# Altium schematic sheet FPGA_52_Keyboard.SchDoc
size B; Organization: Altium Limited; Address1: L3, 12a Rodborough Rd; Address2: Frenchs Forest; Address3: NSW; Address4: Australia 2086; DocumentNumber: 1; SheetNumber: 1; SheetTotal: 2
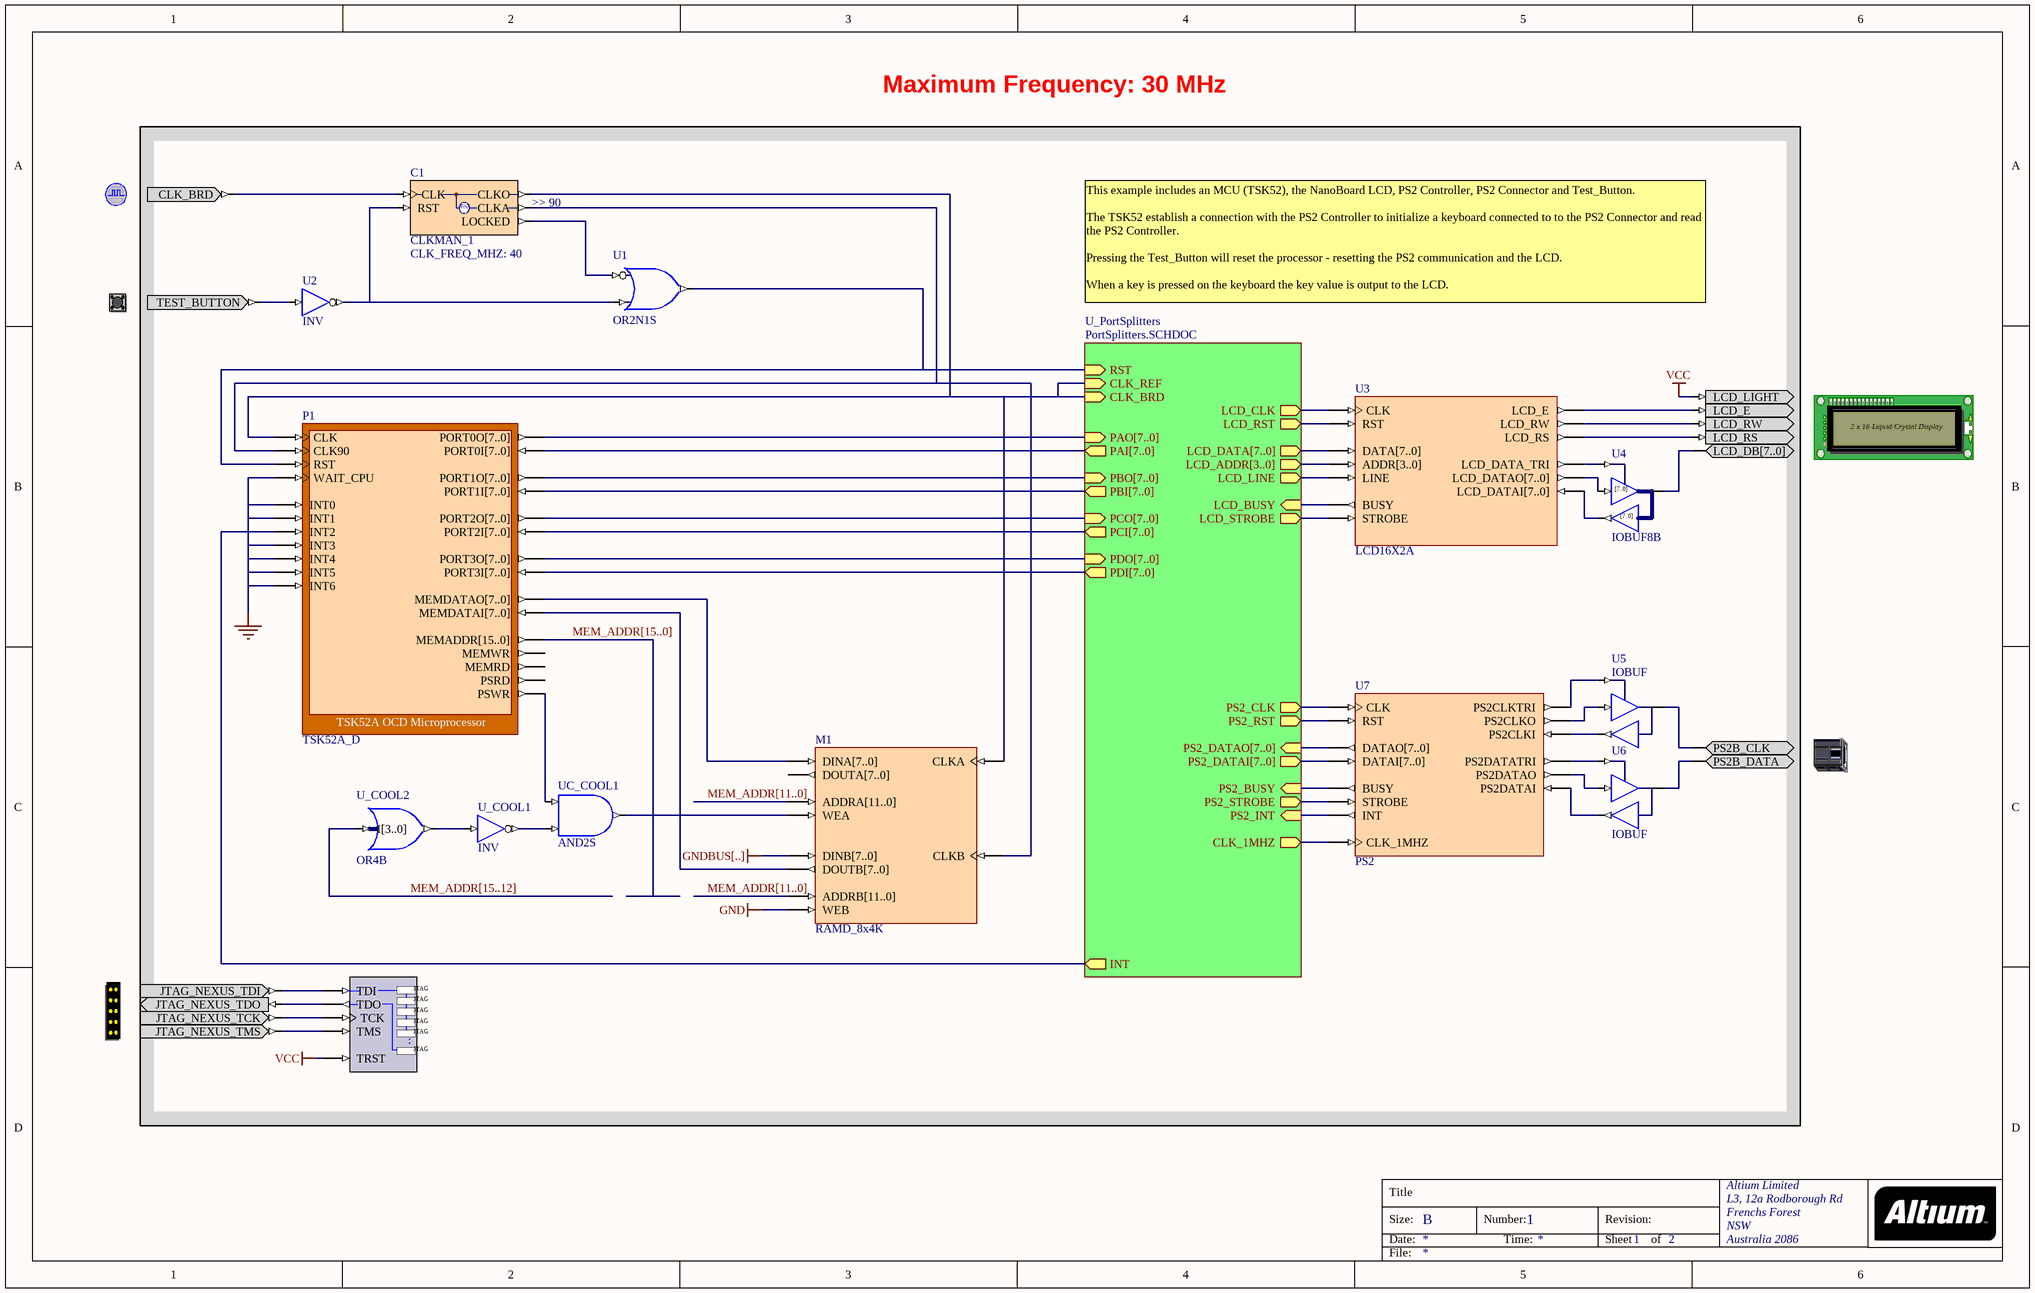
[diagram p0: FPGA_52_Keyboard.SchDoc]

## Parts
(Parts that share a designator on the sheet are numbered #1, #2 ... from top to bottom, then left to right.)
?#1  CLOCK_BOARD  (value not drawn)
?#2  TEST_BUTTON  (value not drawn)
?#3  LCD  (value not drawn)
?#4  PS2B  (value not drawn)
?#5  NEXUS_JTAG_CONNECTOR  (value not drawn)
C1  CLKMAN_1  CLK_FREQ_MHZ: 40  ClkA_Operation: >> 90
M1  RAMD_8x4K
NEXUS_JTAG_PORT  NEXUS_JTAG_PORT  (value not drawn)
P1  TSK52A_D
U1  OR2N1S
U2  INV
U3  LCD16X2A
U4  IOBUF8B
U5  IOBUF
U6  IOBUF
U7  PS2
U_COOL1  INV
U_COOL2  OR4B
UC_COOL1  AND2S

## Sub-sheets
U_PortSplitters = PortSplitters.SCHDOC: PAO[7..0] (in), PBO[7..0] (in), PCO[7..0] (in), PDO[7..0] (in), PAI[7..0] (out), PBI[7..0] (out), PCI[7..0] (out), PDI[7..0] (out), LCD_DATA[7..0] (out), LCD_ADDR[3..0] (out), LCD_LINE (out), LCD_STROBE (out), LCD_BUSY (in), PS2_DATAI[7..0] (out), PS2_BUSY (in), PS2_STROBE (out), PS2_INT (in), INT (out), CLK_1MHZ (out), CLK_REF (in), CLK_BRD (in), RST (in), PS2_CLK (out), PS2_RST (out), LCD_RST (out), LCD_CLK (out), PS2_DATAO[7..0] (in)

## Nets
GND: M1.WEB P1.INT0 P1.INT1 P1.INT3 P1.INT4 P1.INT5 P1.INT6 P1.WAIT_CPU
GNDBUS[..]: M1.DINB[7..0]
VCC: ?#3.LCD_LIGHT NEXUS_JTAG_PORT.TRST
MEM_ADDR[11..0]: M1.ADDRA[11..0] M1.ADDRB[11..0]
MEM_ADDR[15..0]: P1.MEMADDR[15..0]
MEM_ADDR[15..12]: U_COOL2.I[3..0]
Net?#1_CLK_BRD: ?#1.CLK_BRD C1.CLK
Net?#2_TEST_BUTTON: ?#2.TEST_BUTTON U2.I
Net?#3_LCD_DB[7..0]: ?#3.LCD_DB[7..0] U4.IO[7..0]
Net?#3_LCD_E: ?#3.LCD_E U3.LCD_E
Net?#3_LCD_RS: ?#3.LCD_RS U3.LCD_RS
Net?#3_LCD_RW: ?#3.LCD_RW U3.LCD_RW
Net?#4_PS2B_CLK: ?#4.PS2B_CLK U5.IO
Net?#4_PS2B_DATA: ?#4.PS2B_DATA U6.IO
Net?#5_JTAG_NEXUS_TCK: ?#5.JTAG_NEXUS_TCK NEXUS_JTAG_PORT.TCK
Net?#5_JTAG_NEXUS_TDI: ?#5.JTAG_NEXUS_TDI NEXUS_JTAG_PORT.TDI
Net?#5_JTAG_NEXUS_TDO: ?#5.JTAG_NEXUS_TDO NEXUS_JTAG_PORT.TDO
Net?#5_JTAG_NEXUS_TMS: ?#5.JTAG_NEXUS_TMS NEXUS_JTAG_PORT.TMS
NetC1_CLKA: C1.CLKA M1.CLKB P1.CLK90
NetC1_CLKO: C1.CLKO M1.CLKA P1.CLK ; sheet U_PortSplitters/CLK_REF, sheet U_PortSplitters/CLK_BRD
NetC1_LOCKED: C1.LOCKED U1.I0
NetC1_RST: C1.RST U1.I1 U2.O
NetM1_DINA[7..0]: M1.DINA[7..0] P1.MEMDATAO[7..0]
NetM1_DOUTB[7..0]: M1.DOUTB[7..0] P1.MEMDATAI[7..0]
NetM1_WEA: M1.WEA UC_COOL1.O
NetP1_INT2: P1.INT2 ; sheet U_PortSplitters/INT
NetP1_PORT0I[7..0]: P1.PORT0I[7..0] ; sheet U_PortSplitters/PAI[7..0]
NetP1_PORT0O[7..0]: P1.PORT0O[7..0] ; sheet U_PortSplitters/PAO[7..0]
NetP1_PORT1I[7..0]: P1.PORT1I[7..0] ; sheet U_PortSplitters/PBI[7..0]
NetP1_PORT1O[7..0]: P1.PORT1O[7..0] ; sheet U_PortSplitters/PBO[7..0]
NetP1_PORT2I[7..0]: P1.PORT2I[7..0] ; sheet U_PortSplitters/PCI[7..0]
NetP1_PORT2O[7..0]: P1.PORT2O[7..0] ; sheet U_PortSplitters/PCO[7..0]
NetP1_PORT3I[7..0]: P1.PORT3I[7..0] ; sheet U_PortSplitters/PDI[7..0]
NetP1_PORT3O[7..0]: P1.PORT3O[7..0] ; sheet U_PortSplitters/PDO[7..0]
NetP1_PSWR: P1.PSWR UC_COOL1.I0
NetP1_RST: P1.RST U1.O ; sheet U_PortSplitters/RST
NetU3_ADDR[3..0]: U3.ADDR[3..0] ; sheet U_PortSplitters/LCD_ADDR[3..0]
NetU3_BUSY: U3.BUSY ; sheet U_PortSplitters/LCD_BUSY
NetU3_CLK: U3.CLK ; sheet U_PortSplitters/LCD_CLK
NetU3_DATA[7..0]: U3.DATA[7..0] ; sheet U_PortSplitters/LCD_DATA[7..0]
NetU3_LCD_DATA_TRI: U3.LCD_DATA_TRI U4.T
NetU3_LCD_DATAI[7..0]: U3.LCD_DATAI[7..0] U4.O[7..0]
NetU3_LCD_DATAO[7..0]: U3.LCD_DATAO[7..0] U4.I[7..0]
NetU3_LINE: U3.LINE ; sheet U_PortSplitters/LCD_LINE
NetU3_RST: U3.RST ; sheet U_PortSplitters/LCD_RST
NetU3_STROBE: U3.STROBE ; sheet U_PortSplitters/LCD_STROBE
NetU5_I: U5.I U7.PS2CLKO
NetU5_O: U5.O U7.PS2CLKI
NetU5_T: U5.T U7.PS2CLKTRI
NetU6_I: U6.I U7.PS2DATAO
NetU6_O: U6.O U7.PS2DATAI
NetU6_T: U6.T U7.PS2DATATRI
NetU7_BUSY: U7.BUSY ; sheet U_PortSplitters/PS2_BUSY
NetU7_CLK: U7.CLK ; sheet U_PortSplitters/PS2_CLK
NetU7_CLK_1MHZ: U7.CLK_1MHZ ; sheet U_PortSplitters/CLK_1MHZ
NetU7_DATAI[7..0]: U7.DATAI[7..0] ; sheet U_PortSplitters/PS2_DATAI[7..0]
NetU7_DATAO[7..0]: U7.DATAO[7..0] ; sheet U_PortSplitters/PS2_DATAO[7..0]
NetU7_INT: U7.INT ; sheet U_PortSplitters/PS2_INT
NetU7_RST: U7.RST ; sheet U_PortSplitters/PS2_RST
NetU7_STROBE: U7.STROBE ; sheet U_PortSplitters/PS2_STROBE
NetU_COOL1_I: U_COOL1.I U_COOL2.O
NetU_COOL1_O: U_COOL1.O UC_COOL1.I1

Not connected (* = marked no-connect by the designer): M1 DOUTA[7..0]; P1 MEMRD MEMWR PSRD

## Buses and harness runs
bus MEM_ADDR[11..0]
bus MEM_ADDR[15..0]
bus MEM_ADDR[15..12]

## Notes on the sheet
- Maximum Frequency: 30 MHz
- This example includes an MCU (TSK52), the NanoBoard LCD, PS2 Controller, PS2 Connector and Test_Button.
  The TSK52 establish a connection with the PS2 Controller to initialize a keyboard connected to to the PS2 Connector and read the PS2 Controller.
  Pressing the Test_Button will reset the processor - resetting the PS2 communication and the LCD.
  When a key is pressed on the keyboard the key value is output to the LCD.
- Title
- Size:
- Date:
- B
- Number:
- Time:
- Revision:
- Sheet
- of
- File:
- (in symbol CLKMAN_1) F(x)
- (in symbol IOBUF8B) [7..0]
- (in symbol LCD) 2 x 16 Liquid Crystal Display
- (in symbol NEXUS_JTAG_PORT) JTAG; .

## Library data of the parts
?#1 = CLOCK_BOARD: Global System Clock Supply; PortComponent: True; Published: 19-Nov-2003; Publisher: Altium Limited
?#2 = TEST_BUTTON: Test Button; PortComponent: True; Published: 19-Nov-2003; Publisher: Altium Limited
?#3 = LCD: Liquid Crystal Display; PortComponent: True; Published: 19-Nov-2003; Publisher: Altium Limited
?#4 = PS2B: Key Board PS2 Connector; PortComponent: True; Published: 19-Nov-2003; Publisher: Altium Limited
?#5 = NEXUS_JTAG_CONNECTOR: JTAG Port; PortComponent: True; Published: 19-Nov-2003; Publisher: Altium Limited
C1 = CLKMAN_1: Single Operational Output Clock Manager; Clk_Count: 1; Published: 5-Jul-2004; Publisher: Altium Limited; Core Revision: 1.00.00; Nexus_Core: ClockManager; HelpURL: CR0118 FPGA Generic Library Guide.pdf#page=148; Functional Class: Clock Manager; Port Size: 1
M1 = RAMD_8x4K: Dual Port Random Access Memory; Memory_DepthA: 4096; Memory_Type: RAM_DualPortBlock; Memory_WidthA: 8; Memory_ClockEdge: Rising; Nexus_Core: Memory_Program; Published: 13/01/2004; Publisher: Altium Hobart Technology Center; Memory_DepthB: 4096; Memory_WidthB: 8
NEXUS_JTAG_PORT = NEXUS_JTAG_PORT: Soft Nexus-Chain Connector; NEXUS_JTAG_CONNECTOR: True; Published: 18-Dec-2003; Publisher: Altium Limited
P1 = TSK52A_D: TSK52A OCD Microprocessor; NEXUS_CORE: Processor_OCDS; NEXUS_JTAG_DEVICE: True; NEXUS_JTAG_ORDER: 0; ChildModel1: TSK52A_D_DRAM8X256; ChildCore1: M1; Memory_Configuration: Record[NEXUS_CORE]{}ComponentDesignator[iram]{}Memory_Depth[256]{}Memory_UsageType[ram]{}ProgramDownloadAddress[0x0]{}Memory_BusType[c51:idata_bus]{n}Record[NEXUS_CORE]{}ComponentDesignator[xram]{}Memory_Depth[64k]{}Memory_UsageType[ram]{}ProgramDownloadAddress[0x0]{}Memory_BusType[c51:xdata_bus]{n}Record[NEXUS_CORE]{}ComponentDesignator[xrom]{}Memory_Depth[64k]{}Memory_UsageType[rom]{}ProgramDownloadAddress[0x0]{}Memory_BusType[c51:code_bus]{n}; Published: 1/12/2003; Publisher: Altium Hobart Technology Centre; Core Revision: 1.00.00
U1 = OR2N1S: 2-Input OR Gate with Active Low A Input, Single Pin Version; Xilinx Equivalent: OR2B1; ArchiveName: GENERIC; VHDLIB_SIM: GENERIC_LIB; Published: 29-Jan-2004; Publisher: Altium Limited; Core Revision: 1.00.00
U2 U_COOL1 = INV: Inverter; ArchiveName: GENERIC; VHDLIB_SIM: GENERIC_LIB; Published: 29-Jan-2004; Publisher: Altium Limited; Xilinx Equivalent: INV; Core Revision: 1.00.00
U3 = LCD16X2A: LCD Controller; Published: 5/01/2004; Publisher: Altium Hobart Technology Centre; Core Revision: 1.00.00
U4 = IOBUF8B: 8-Bit Input/Output Buffer, Bus Version; ArchiveName: GENERIC; Published: 18-Dec-2003; Publisher: Altium Limited; Core Revision: 1.00.00
U5 U6 = IOBUF: Input/Output Buffer; ArchiveName: GENERIC; Published: 18-Nov-2003; Publisher: Altium Limited; Xilinx Equivalent: IOBUF; Core Revision: 1.00.00
U7 = PS2: PS2 Controller; Published: 3/02/2004; Publisher: Altium Hobart Technology Centre; Core Revision: 1.00.00
U_COOL2 = OR4B: 4-Input OR Gate, Bus Version; ArchiveName: GENERIC; VHDLIB_SIM: GENERIC_LIB; Published: 29-Jan-2004; Publisher: Altium Limited; Core Revision: 1.00.00
UC_COOL1 = AND2S: 2-Input AND Gate, Single Pin Version; Xilinx Equivalent: AND2; ArchiveName: GENERIC; VHDLIB_SIM: GENERIC_LIB; Published: 29-Jan-2004; Publisher: Altium Limited; Core Revision: 1.00.00